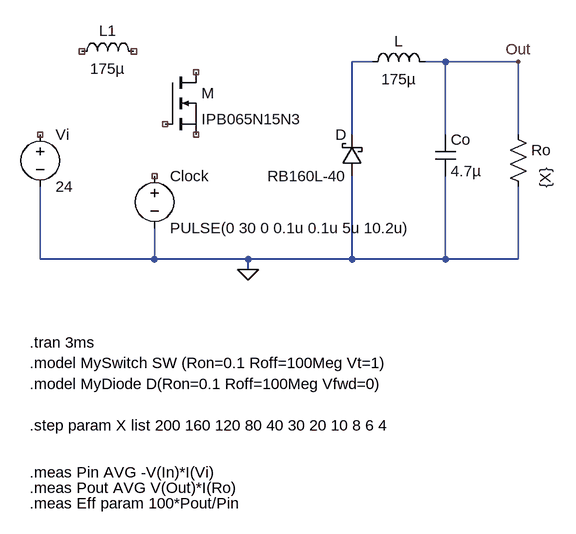
[diagram p0: schematic Buck Converter Efficienza.asc]
Buck Converter Efficienza.asc, the LTspice schematic file:
Version 4.1
SHEET 1 880 680
WIRE 128 -64 96 -64
WIRE 240 -64 208 -64
WIRE 352 -64 240 -64
WIRE 96 48 96 -64
WIRE 240 48 240 -64
WIRE 352 48 352 -64
WIRE -384 240 -384 128
WIRE -208 240 -208 192
WIRE -208 240 -384 240
WIRE -64 240 -208 240
WIRE 96 240 96 112
WIRE 96 240 -64 240
WIRE 240 240 240 112
WIRE 240 240 96 240
WIRE 352 240 352 128
WIRE 352 240 240 240
WIRE -64 256 -64 240
FLAG -64 256 0
FLAG 352 -64 Out
SYMBOL nmos -192 -48 R0
SYMATTR InstName M
SYMATTR Value IPB065N15N3
SYMBOL ind 112 -48 R270
WINDOW 0 32 56 VTop 2
WINDOW 3 5 56 VBottom 2
SYMATTR InstName L
SYMATTR Value 175µ
SYMBOL schottky 112 112 R180
WINDOW 0 24 64 Left 2
WINDOW 3 24 0 Left 2
SYMATTR InstName D
SYMATTR Value RB160L-40
SYMATTR Description Diode
SYMATTR Type diode
SYMBOL cap 224 48 R0
SYMATTR InstName Co
SYMATTR Value 4.7µ
SYMBOL res 336 32 R0
WINDOW 3 58 99 VLeft 2
SYMATTR Value {X}
SYMATTR InstName Ro
SYMBOL voltage -208 96 R0
WINDOW 123 0 0 Left 2
WINDOW 39 0 0 Left 2
SYMATTR InstName Clock
SYMATTR Value PULSE(0 30 0 0.1u 0.1u 5u 10.2u)
SYMBOL voltage -384 32 R0
WINDOW 123 0 0 Left 2
WINDOW 39 0 0 Left 2
SYMATTR InstName Vi
SYMATTR Value 24
SYMBOL ind -336 -64 R270
WINDOW 0 32 56 VTop 2
WINDOW 3 5 56 VBottom 2
SYMATTR InstName L1
SYMATTR Value 175µ
TEXT -400 368 Left 2 !.tran 3ms
TEXT -400 400 Left 2 !.model MySwitch SW (Ron=0.1 Roff=100Meg Vt=1)
TEXT -400 432 Left 2 !.model MyDiode D(Ron=0.1 Roff=100Meg Vfwd=0)
TEXT -400 496 Left 2 !.step param X list 200 160 120 80 40 30 20 10 8 6 4
TEXT -400 616 Left 2 !.meas Eff param 100*Pout/Pin
TEXT -400 568 Left 2 !.meas Pin AVG -V(In)*I(Vi)
TEXT -400 592 Left 2 !.meas Pout AVG V(Out)*I(Ro)

The netlist it stands for:
* Buck Converter Efficienza.asc
M NC_01 NC_02 NC_03 NC_03 IPB065N15N3
L N001 Out 175µ
D 0 N001 RB160L-40
Co Out 0 4.7µ
Ro Out 0 {X}
V§Clock NC_04 0 PULSE(0 30 0 0.1u 0.1u 5u 10.2u)
Vi NC_05 0 24
L1 NC_06 NC_07 175µ
.model D D
.lib standard.dio
.model NMOS NMOS
.model PMOS PMOS
.lib standard.mos
.tran 3ms
.model MySwitch SW (Ron=0.1 Roff=100Meg Vt=1)
.model MyDiode D(Ron=0.1 Roff=100Meg Vfwd=0)
.step param X list 200 160 120 80 40 30 20 10 8 6 4
.meas Eff param 100*Pout/Pin
.meas Pin AVG -V(In)*I(Vi)
.meas Pout AVG V(Out)*I(Ro)
.backanno
.end